# EAGLE design AirSensor_LoRA (EAGLE 9.6.2)
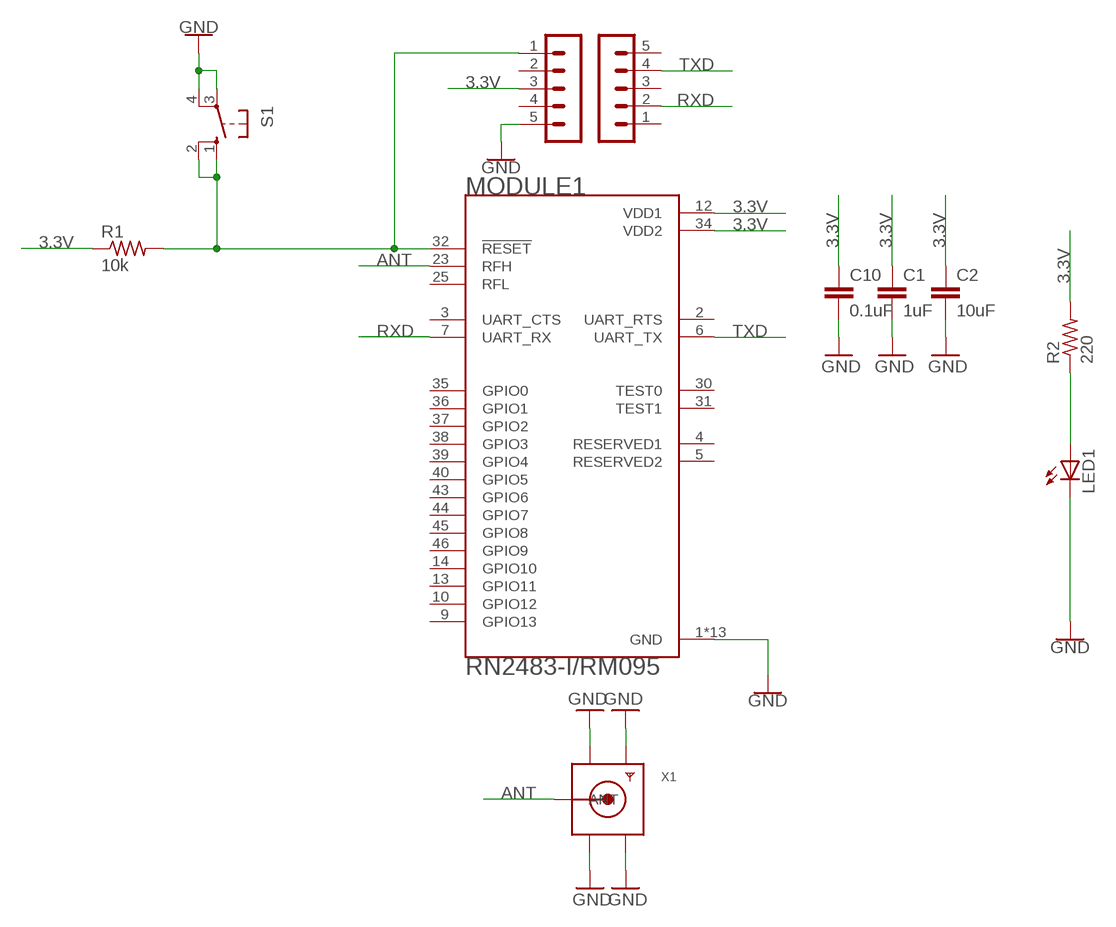
[diagram p0: schematic, sheet 1]

## Parts
C1  1uF  1.0UF-0805-25V-10%  [0805]
C2  10uF  1.0UF-0805-25V-10%  [0805]
C10  0.1uF  1.0UF-0805-25V-10%  [0805]
LED1  LEDCHIPLED_0805  [CHIPLED_0805]
MODULE1  RN2483-I/RM095  [MICROCHIP_RN2483-I/RM095]
R1  10k  CRCW08050000Z0EA  [RES_0805]
R2  220  CRCW08050000Z0EA  [RES_0805]
RFM95W_1  LoRa_1  MA05-1  [MA05-1]
RFM95W_2  LoRa_2  MA05-1  [MA05-1]
S1  10-XX  [B3F-10XX]
X1  SMACONNECTOR_EDGE  [SMA_EDGELAUNCH]

## Nets
3.3V: C1.1 C2.1 C10.1 MODULE1.12(VDD1) MODULE1.34(VDD2) R1.1 R2.2 RFM95W_1.3
ANT: MODULE1.23(RFH) X1.P(ANT)
GND: C1.2 C2.2 C10.2 LED1.C MODULE1.1(GND) MODULE1.8(GND) MODULE1.11(GND) MODULE1.20(GND) MODULE1.21(GND) MODULE1.22(GND) MODULE1.24(GND) MODULE1.26(GND) MODULE1.27(GND) MODULE1.28(GND) MODULE1.33(GND) MODULE1.41(GND) MODULE1.47(GND) RFM95W_1.5 S1.3(P) S1.4(P1) X1.GND@1(GND4) X1.GND@2(GND3) X1.GND@3(GND2) X1.GND@4(GND1)
N$8: LED1.A R2.1
N$13: MODULE1.32(!RESET) R1.2 RFM95W_1.1 S1.1(S) S1.2(S1)
RXD: MODULE1.7(UART_RX) RFM95W_2.2
TXD: MODULE1.6(UART_TX) RFM95W_2.4
Unconnected: MODULE1.2(UART_RTS) MODULE1.3(UART_CTS) MODULE1.4(RESERVED1) MODULE1.5(RESERVED2) MODULE1.9(GPIO13) MODULE1.10(GPIO12) MODULE1.13(GPIO11) MODULE1.14(GPIO10) MODULE1.25(RFL) MODULE1.30(TEST0) MODULE1.31(TEST1) MODULE1.35(GPIO0) MODULE1.36(GPIO1) MODULE1.37(GPIO2) MODULE1.38(GPIO3) MODULE1.39(GPIO4) MODULE1.40(GPIO5) MODULE1.43(GPIO6) MODULE1.44(GPIO7) MODULE1.45(GPIO8) MODULE1.46(GPIO9) RFM95W_1.2 RFM95W_1.4 RFM95W_2.1 RFM95W_2.3 RFM95W_2.5

## Library data of the parts
C1 C2 C10 = SparkFun-Capacitors:1.0UF: 1µF ceramic capacitors A capacitor is a passive two-terminal electrical component used to store electrical energy temporarily in an electric field.; PROD_ID: CAP-08064; VALUE: 1.0uF
LED1 = adafruit:LED: LED OSRAM: - CHIPLED LG R971, LG N971, LY N971, LG Q971, LY Q971, LO R971, LY R971 LH N974, LH R974 LS Q976, LO Q976, LY Q976 LO Q996 - Hyper CHIPLED LW Q18S LB Q993, LB Q99A, LB R99A - SideLED LS A670, LO A670, LY A670, LG A670, LP A670 LB A673, LV A673, LT A673, LW A673 LH A674 LY A675 LS A676, LA A676, LO A676, LY A676, LW A676 LS A679, LY A679, LG A679 - Hyper Micro SIDELED® LS Y876, LA Y876, LO Y876, LY Y876 LT Y87S - SmartLED LW L88C, LW L88S LB L89C, LB L89S, LG L890 LS L89K, LO L89K, LY L89K LS L896, LA L896, LO L896, LY L896 - TOPLED LS T670, LO T670, LY T670, LG T670, LP T670 LSG T670, LSP T670, LSY T670, LOP T670, LYG T670 LG T671, LOG T671, LSG T671 LB T673, LV T673, LT T673, LW T673 LH T674 LS T676, LA T676, LO T676, LY T676, LB T676, LH T676, LSB T676, LW T676 LB T67C, LV T67C, LT T67C, LS T67K, LO T67K, LY T67K, LW E67C LS E67B, LA E67B, LO E67B, LY E67B, LB E67C, LV E67C, LT E67C LW T67C LS T679, LY T679, LG T679 LS T770, LO T770, LY T770, LG T770, LP T770 LB T773, LV T773, LT T773, LW T773 LH T774 LS E675, LA E675, LY E675, LS T675 LS T776, LA T776, LO T776, LY T776, LB T776 LHGB T686 LT T68C, LB T68C - Hyper Mini TOPLED® LB M676 - Mini TOPLED Santana® LG M470 LS M47K, LO M47K, LY M47K Source: http://www.osram.convergy.de/
MODULE1 = RN2483-I_RM095 (3):RN2483-I/RM095: Sub-GHz Dual Band Long Range Transceiver LoRa Module Check prices <https://pricing.snapeda.com/parts/RN2483-I/RM095/Microchip/view-part?ref=eda>; AVAILABILITY: Bad; DESCRIPTION: Sub-GHz Dual Band Long Range Transceiver LoRa Module; MF: Microchip; MP: RN2483-I/RM095; PACKAGE: None; PRICE: None
R1 R2 = Resistor_Capacitor:CRCW08050000Z0EA: RES SMD 0 OHM JUMPER 1/8W 0805 Manufacturer's datasheet <http://www.vishay.com/docs/20035/dcrcwe3.pdf>; CREATED_BY: PCBLayout.com; DIGIKEY_PART_NUMBER: 541-0.0ATR-ND; MANUFACTURER: Vishay Dale; MPN: CRCW08050000Z0EA; PACKAGE: SMD 0805
RFM95W_1 RFM95W_2 = con-lstb:MA05-1: PIN HEADER; OC_FARNELL: unknown; OC_NEWARK: unknown
S1 = switch-omron:10-XX: OMRON SWITCH; MPN: B3F-1000; OC_FARNELL: 176432; OC_NEWARK: 36M3542
X1 = adafruit:SMACONNECTOR: SMA Connector 90° DIP SMA Connector, 50 Ohm (4UConnector: 07259)

## Board
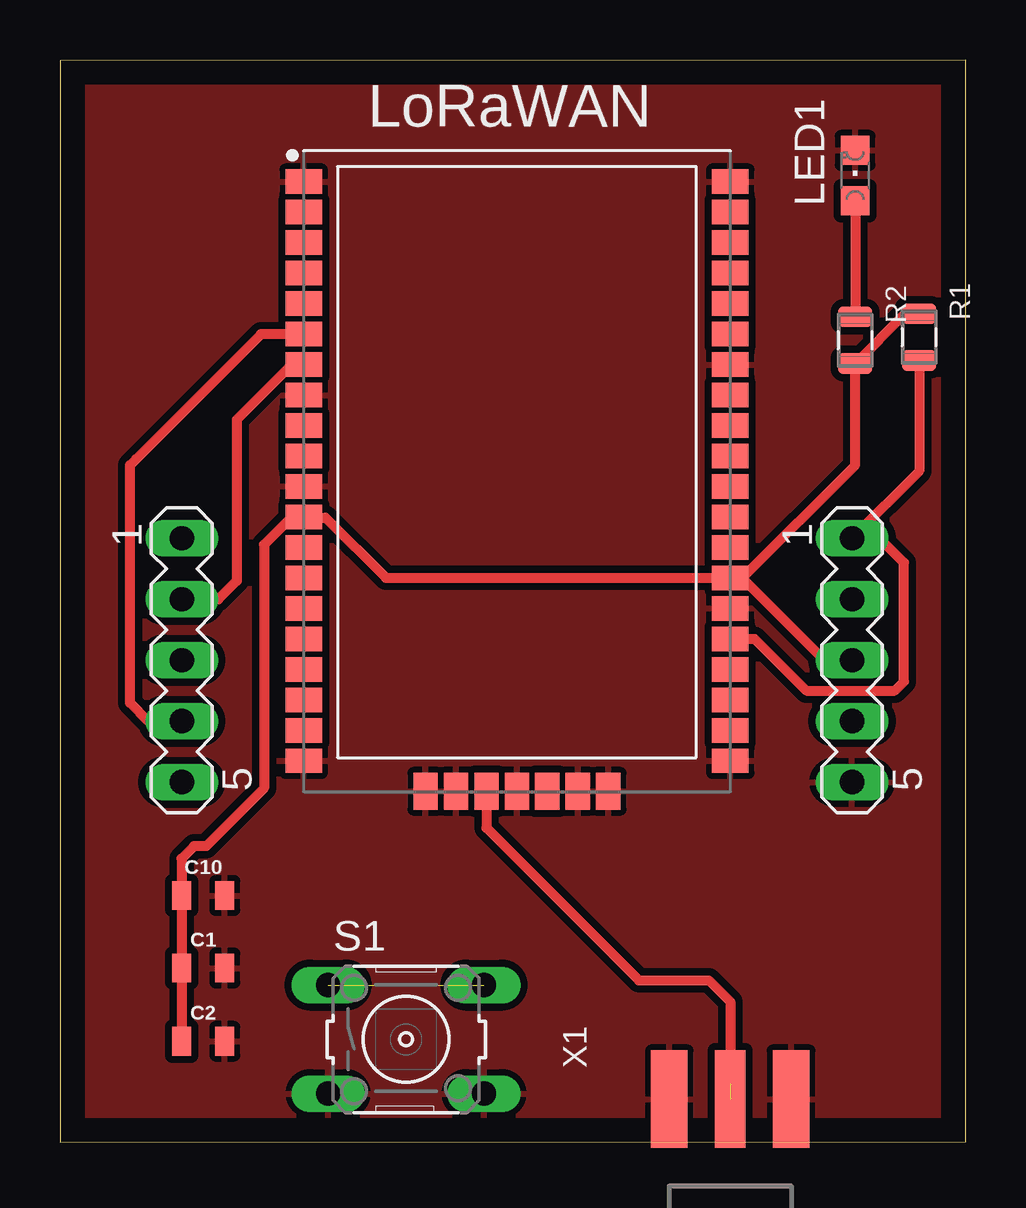
[diagram p1: board, top side]
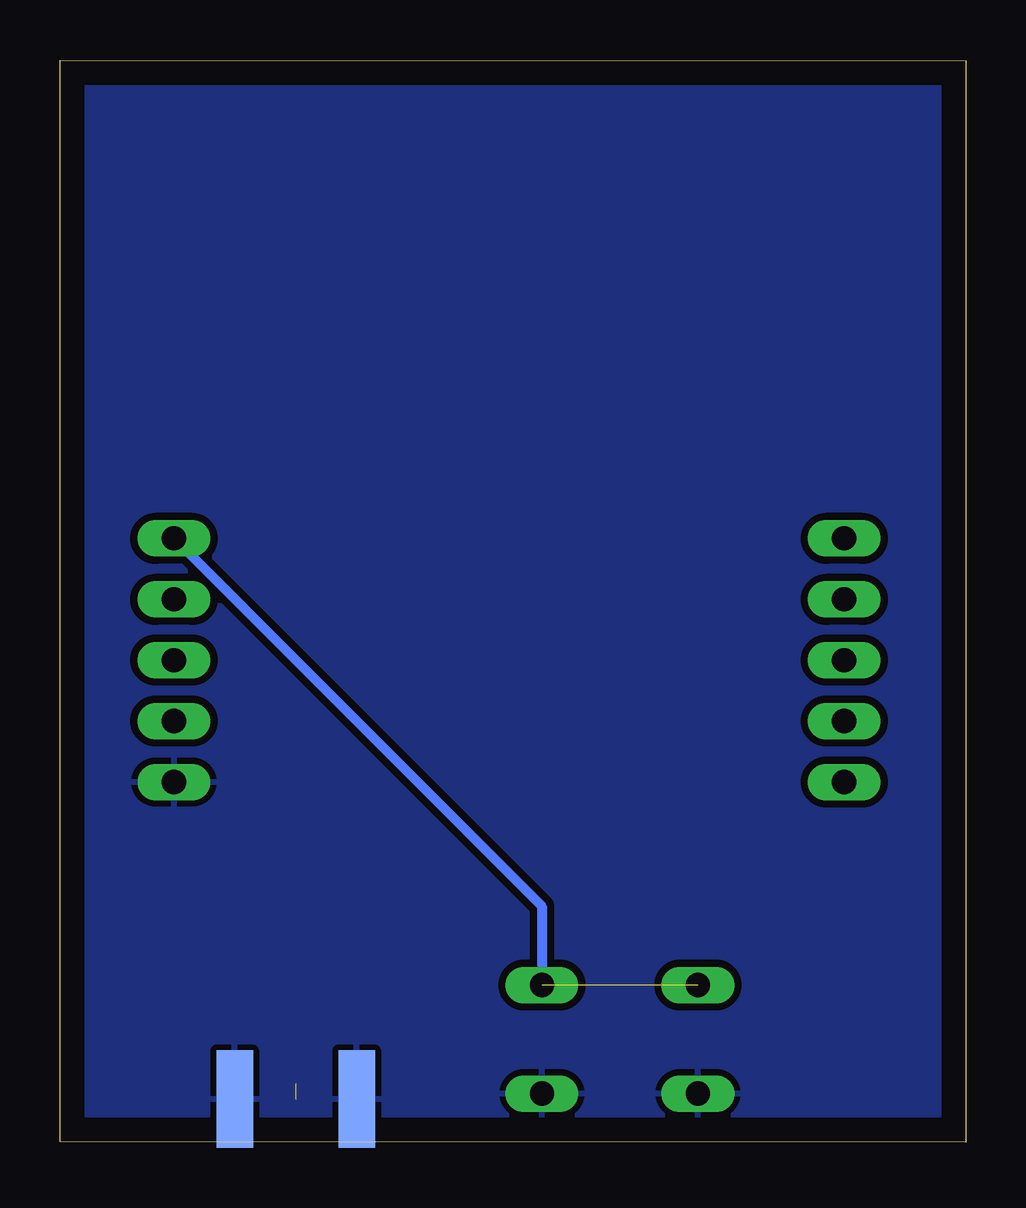
[diagram p2: board, bottom side, seen from below]

Size 37.77 x 45.1 mm. Coordinates in mm from the lower left corner, seen from the top.
Outline: 0,0 37.77,0.03 37.77,45.1 0,45.08 0,0
Copper layers (1*16): Top 0.035mm / dielectric 1.5mm / Bottom 0.035mm
Design rules "default": minimum track width 6mil, minimum drill 0.35mm, track to track 6mil, track to pad 6mil, pad to pad 6mil, via to via 6mil, smd to smd 6mil, copper to edge 40mil, drill to drill 6mil, minimum pad ring 10mil, minimum via ring 8mil, stop-mask expansion 4mil, vias tented up to drill 0mil, thermal gap 10mil

### Footprints (pad centres in the part's own frame; a part is rotated, then mirrored left to right if it is on the bottom)
0805 = smd 0.8 x 1.2: 1 -0.9,0; 2 0.9,0
CHIPLED_0805 = smd 1.2 x 1.2: A 0,-1.05; C 0,1.05
MICROCHIP_RN2483-I/RM095 = smd 1.524 x 1.016: 1 -8.89,12.065; 2 -8.89,10.795; 3 -8.89,9.525; 4 -8.89,8.255; 5 -8.89,6.985; 6 -8.89,5.715; 7 -8.89,4.445; 8 -8.89,3.175; 9 -8.89,1.905; 10 -8.89,0.635; 11 -8.89,-0.635; 12 -8.89,-1.905; 13 -8.89,-3.175; 14 -8.89,-4.445; 15 -8.89,-5.715; 16 -8.89,-6.985; 17 -8.89,-8.255; 18 -8.89,-9.525; 19 -8.89,-10.795; 20 -8.89,-12.065; 28 8.89,-12.065; 29 8.89,-10.795; 30 8.89,-9.525; 31 8.89,-8.255; 32 8.89,-6.985; 33 8.89,-5.715; 34 8.89,-4.445; 35 8.89,-3.175; 36 8.89,-1.905; 37 8.89,-0.635; 38 8.89,0.635; 39 8.89,1.905; 40 8.89,3.175; 41 8.89,4.445; 42 8.89,5.715; 43 8.89,6.985; 44 8.89,8.255; 45 8.89,9.525; 46 8.89,10.795; 47 8.89,12.065 | smd 1.016 x 1.524: 21 -3.81,-13.335; 22 -2.54,-13.335; 23 -1.27,-13.335; 24 0,-13.335; 25 1.27,-13.335; 26 2.54,-13.335; 27 3.81,-13.335
RES_0805 = smd 0.87 x 1.42: 1 -0.975,0; 2 0.975,0
MA05-1 = drill 1.016 long: 1 -5.08,0; 2 -2.54,0; 3 0,0; 4 2.54,0; 5 5.08,0
B3F-10XX = drill 1.016 long: 1 -3.251,2.261; 2 3.251,2.261; 3 -3.251,-2.261; 4 3.251,-2.261
SMA_EDGELAUNCH = smd 4.064 x 1.524: GND@1 2.032,-2.54; GND@2 2.032,2.54 | smd 4.064 x 1.524 bottom: GND@3 2.032,2.54; GND@4 2.032,-2.54 | smd 4.064 x 1.27: P 2.032,0

### Placement (x,y rotation side)
C1  5.97,7.26 0 top
C2  5.97,4.22 0 top
C10  5.97,10.29 0 top
LED1  33.15,40.28 0 top
MODULE1  19.05,27.97 0 top
R1  35.81,33.55 270 top
R2  33.15,33.43 270 top
RFM95W_1  33.02,20.09 270 top
RFM95W_2  5.08,20.09 270 top
S1  14.43,4.29 0 top
X1  27.94,-0.23 90 top

### Tracks (layer width: path | path; a pad name or v marks a point on that pad's centre or on a via)
3.3V
  Top 0.406: C2.1 C1.1 C10.1 5.07,11.83 5.59,12.34 6.1,12.34 8.51,14.76 8.51,24.91 9.63,26.04 10.13,26.04 MODULE1.12 10.19,26.04 11.07,26.04 13.58,23.52 MODULE1.34 | MODULE1.34 27.96,23.5 28.47,23.5 31.87,20.09 RFM95W_1.3 | MODULE1.34 27.96,23.55 28.47,23.55 33.15,28.22 R2.2 35.22,34.53 R1.1
ANT  (1 unrouted)
  Top 0.406: MODULE1.23 17.78,13.11 24.13,6.76 27.05,6.76 27.94,5.87 27.94,2.44
GND
  pour Top (isolate 0.305): 0.28,44.62 37.67,44.62 37.67,0.1 0.28,0.1
  pour Bottom (isolate 0.305): 0.41,44.88 37.67,44.88 37.67,0.1 0.41,0.1
N$8
  Top 0.406: LED1.A R2.1
N$13  (1 unrouted)
  Top 0.406: MODULE1.32 28.96,20.98 31.11,18.82 34.8,18.82 35.18,19.2 35.18,24.16 34.16,25.17 RFM95W_1.1 35.81,27.97 R1.2
  Bottom 0.406: RFM95W_1.1 17.68,9.83 S1.2
RXD
  Top 0.406: MODULE1.7 10.13,32.39 9.63,32.39 7.37,30.12 7.37,23.39 6.6,22.63 RFM95W_2.2
TXD
  Top 0.406: RFM95W_2.4 3.68,17.55 2.92,18.31 2.92,28.22 3.17,28.47 8.38,33.68 MODULE1.6

### Text on the board
tNames: LoRaWAN